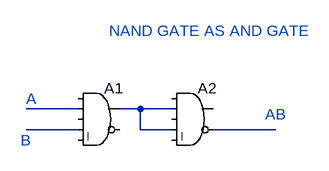
[diagram p0: schematic EXP_2_NAND_AS_AND.asc]
EXP_2_NAND_AS_AND.asc, the LTspice schematic file:
Version 4
SHEET 1 880 680
WIRE 48 80 -32 80
WIRE 144 80 112 80
WIRE 192 80 144 80
WIRE 48 112 -32 112
WIRE 144 112 144 80
WIRE 192 112 144 112
WIRE 352 112 256 112
SYMBOL Digital\\and 80 32 R0
SYMATTR InstName A1
SYMBOL Digital\\and 224 32 R0
SYMATTR InstName A2
TEXT 96 -40 Left 2 ;NAND GATE AS AND GATE
TEXT -32 64 Left 2 ;A
TEXT -40 128 Left 2 ;B
TEXT 336 88 Left 2 ;AB

The netlist it stands for:
* EXP_2_NAND_AS_AND.asc
A1 0 N001 0 N003 0 0 N002 0 AND
A2 0 N002 0 N002 0 N004 0 0 AND
* NAND GATE AS AND GATE
* A
* B
* AB
.backanno
.end